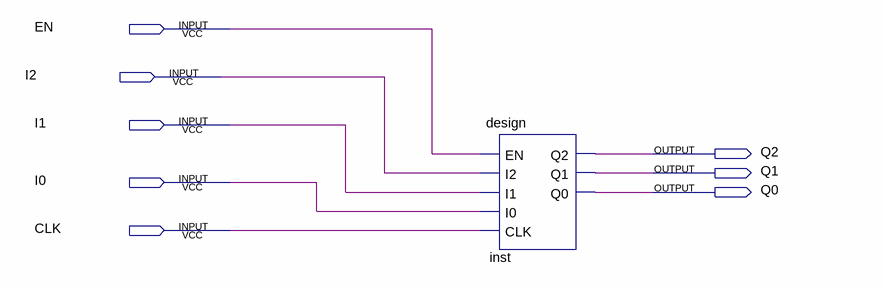
[diagram p0: schematic sheet]
// Quartus schematic lab1_24520867.bdf as structural Verilog: 1 symbols, 8 pins
module lab1_24520867 (
  input  EN,
  input  I2,
  input  I1,
  input  I0,
  input  CLK,
  output Q2,
  output Q1,
  output Q0
);

  \design  inst (.EN(EN), .I2(I2), .I1(I1), .I0(I0), .CLK(CLK), .Q2(Q2), .Q1(Q1), .Q0(Q0));
endmodule
